# EAGLE design BMSv2 (EAGLE 7.6.0)
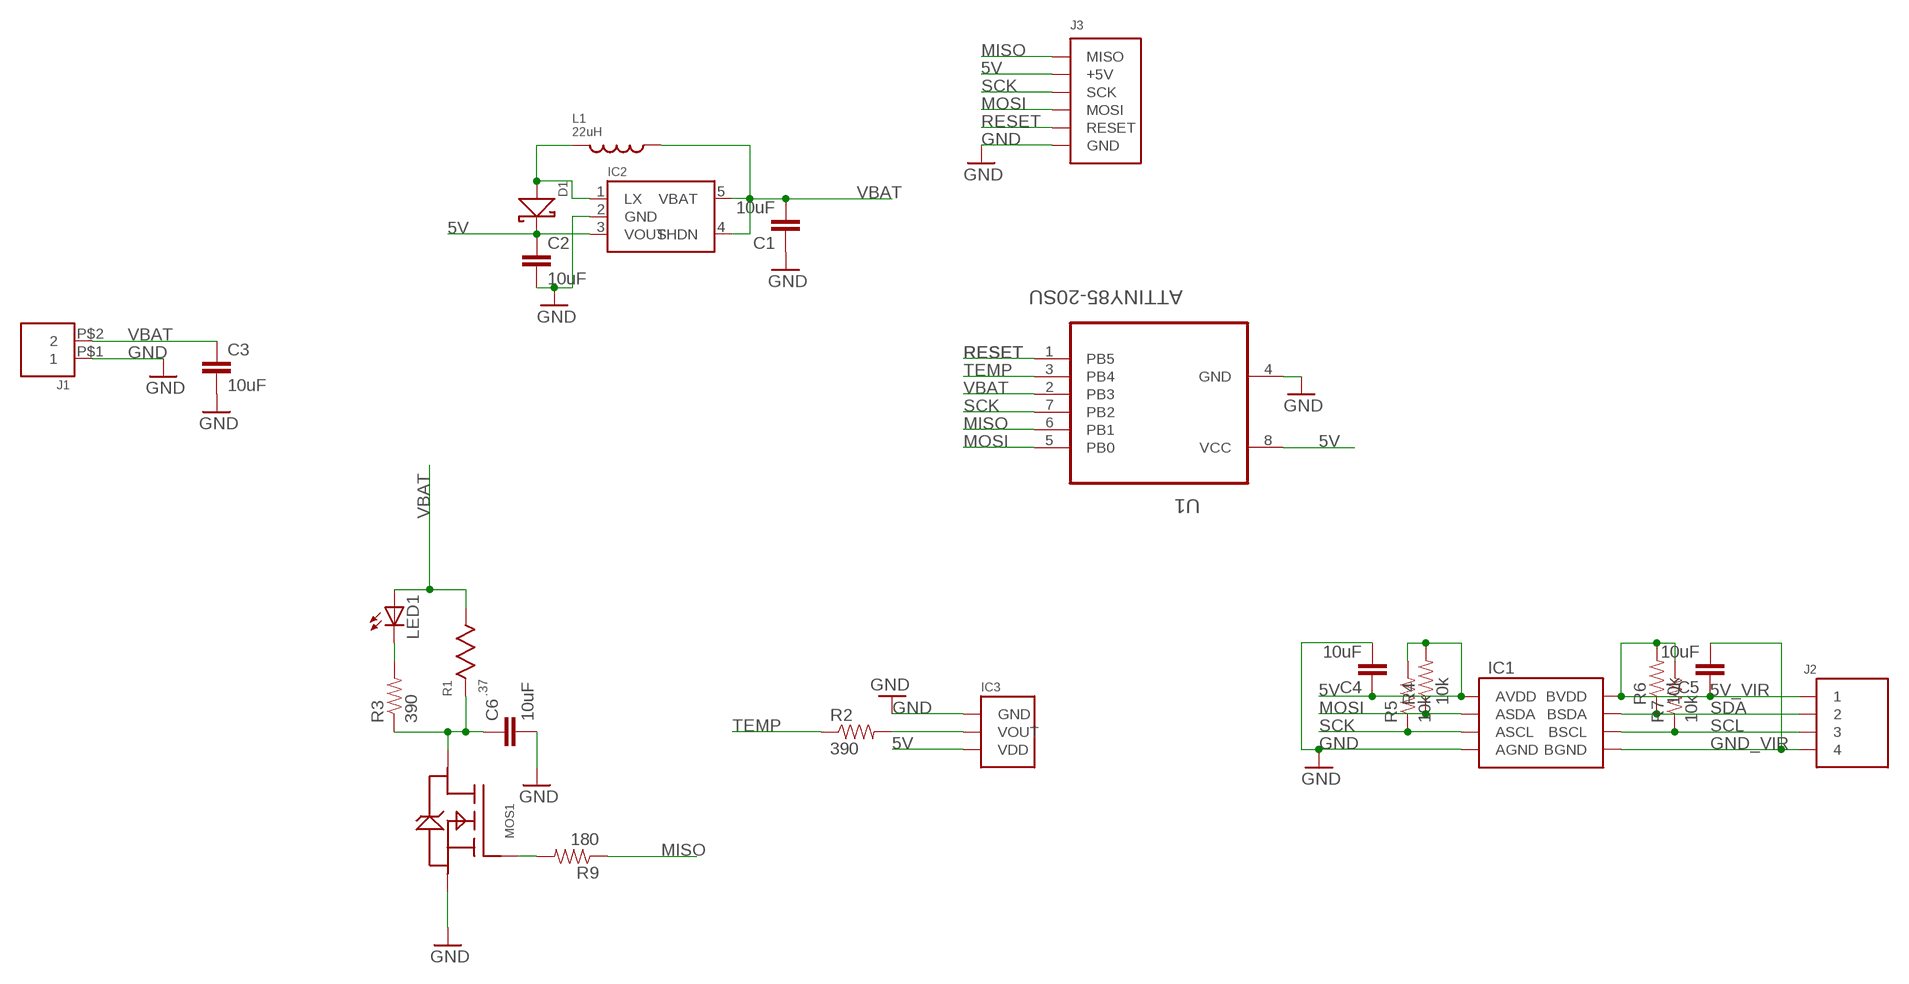
[diagram p0: schematic, sheet 1]

## Parts
C1  10uF  10UF10V10%(0805)  [0805-CAP]
C2  10uF  10UF10V10%(0805)  [0805-CAP]
C3  10uF  10UF10V10%(0805)  [0805-CAP]
C4  10uF  10UF10V10%(0805)  [0805-CAP]
C5  10uF  10UF10V10%(0805)  [0805-CAP]
C6  10uF  10UF10V10%(0805)  [0805-CAP]
D1  DIODE_SCHOTTKYSOD-123  [SOD-123]
IC1  SI8600_DUALCHANNELISO  [SOIC-8]
IC2  SP6641  [SOT-23]
IC3  TEMP_MCP9701  [SOT-23-3]
J1  CONNECTOR_2PIN  [2PIN_.1']
J2  CONNECTOR_4PIN  [4PIN_.1']
J3  ISPHEADER  [2X3PIN_.1']
L1  22uH  CHIP_IND1  [6X6MM_IND]
LED1  LEDCHIPLED_0805  [CHIPLED_0805]
MOS1  MOS_N_LOGIC_PSMN7R0  [LFPAK]
R1  .37  RES_THROUGH  [TO-220-2]
R2  390  0.3OHM-1/8W-1%(0805)  [0805]
R3  390  0.3OHM-1/8W-1%(0805)  [0805]
R4  10k  0.3OHM-1/8W-1%(0805)  [0805]
R5  10k  0.3OHM-1/8W-1%(0805)  [0805]
R6  10k  0.3OHM-1/8W-1%(0805)  [0805]
R7  10k  0.3OHM-1/8W-1%(0805)  [0805]
R9  180  0.3OHM-1/8W-1%(0805)  [0805]
U1  ATTINY85-20SU  [SOIC127P798X216-8N]

## Nets
5V: C2.1 C4.1 D1.CATHODE IC1.P$1(AVDD) IC2.3(VOUT) IC3.1(VDD) J3.P$2(+5V) R4.2 R5.2 U1.8(VCC)
5V_VIR: C5.1 IC1.P$8(BVDD) J2.P$1 R6.2 R7.2
GND: C1.1 C2.2 C3.2 C4.2 C6.2 IC1.P$4(AGND) IC2.2(GND) IC3.3(GND) J1.P$1 J3.P$6(GND) MOS1.P$1(SOURCE) MOS1.P$2(SOURCE) MOS1.P$3(SOURCE) U1.4(GND)
GND_VIR: C5.2 IC1.P$5(BGND) J2.P$4
MISO: J3.P$1(MISO) R9.1 U1.6(PB1)
MOSI: IC1.P$2(ASDA) J3.P$4(MOSI) R4.1 U1.5(PB0)
N$2: MOS1.P$4(GATE) R9.2
N$3: LED1.C R3.2
N$14: C6.1 MOS1.P$5(DRAIN) R1.P$1 R3.1
N$17: IC3.2(VOUT) R2.2
N$29: D1.ANODE IC2.1(LX) L1.P$1
RESET: J3.P$5(RESET) U1.1(PB5)
SCK: IC1.P$3(ASCL) J3.P$3(SCK) R5.1 U1.7(PB2)
SCL: IC1.P$6(BSCL) J2.P$3 R7.1
SDA: IC1.P$7(BSDA) J2.P$2 R6.1
TEMP: R2.1 U1.3(PB4)
VBAT: C1.2 C3.1 IC2.4(SHDN) IC2.5(VBAT) J1.P$2 L1.P$2 LED1.A R1.P$2 U1.2(PB3)

## Library data of the parts
C1-C6 = SparkFun-Capacitors:10UF10V10%(0805): CAP-11330; PROD_ID: CAP-11330
D1 = lolomolo:DIODE_SCHOTTKY
IC1 = lolomolo:SI8600_DUALCHANNELISO
IC2 = lolomolo:SP6641
IC3 = lolomolo:TEMP_MCP9701
J1 = lolomolo:CONNECTOR_2PIN
J2 = lolomolo:CONNECTOR_4PIN
J3 = lolomolo:ISPHEADER
L1 = lolomolo:CHIP_IND: Chip Inductor
LED1 = adafruit:LED: LED OSRAM: - CHIPLED LG R971, LG N971, LY N971, LG Q971, LY Q971, LO R971, LY R971 LH N974, LH R974 LS Q976, LO Q976, LY Q976 LO Q996 - Hyper CHIPLED LW Q18S LB Q993, LB Q99A, LB R99A - SideLED LS A670, LO A670, LY A670, LG A670, LP A670 LB A673, LV A673, LT A673, LW A673 LH A674 LY A675 LS A676, LA A676, LO A676, LY A676, LW A676 LS A679, LY A679, LG A679 - Hyper Micro SIDELED® LS Y876, LA Y876, LO Y876, LY Y876 LT Y87S - SmartLED LW L88C, LW L88S LB L89C, LB L89S, LG L890 LS L89K, LO L89K, LY L89K LS L896, LA L896, LO L896, LY L896 - TOPLED LS T670, LO T670, LY T670, LG T670, LP T670 LSG T670, LSP T670, LSY T670, LOP T670, LYG T670 LG T671, LOG T671, LSG T671 LB T673, LV T673, LT T673, LW T673 LH T674 LS T676, LA T676, LO T676, LY T676, LB T676, LH T676, LSB T676, LW T676 LB T67C, LV T67C, LT T67C, LS T67K, LO T67K, LY T67K, LW E67C LS E67B, LA E67B, LO E67B, LY E67B, LB E67C, LV E67C, LT E67C LW T67C LS T679, LY T679, LG T679 LS T770, LO T770, LY T770, LG T770, LP T770 LB T773, LV T773, LT T773, LW T773 LH T774 LS E675, LA E675, LY E675, LS T675 LS T776, LA T776, LO T776, LY T776, LB T776 LHGB T686 LT T68C, LB T68C - Hyper Mini TOPLED® LB M676 - Mini TOPLED Santana® LG M470 LS M47K, LO M47K, LY M47K Source: http://www.osram.convergy.de/
MOS1 = lolomolo:MOS_N_LOGIC_PSMN7R0
R1 = lolomolo:RES_THROUGH
R2-R7 R9 = SparkFun-Resistors:0.3OHM-1/8W-1%(0805): RES-11622; PROD_ID: RES-11622; VALUE: 0.3
U1 = Atmel_By_element14_Batch_1-00:ATTINY85-20SU: 8-bit Microcontroller with In-System Programmable Flash; MPN: ATTINY85-20SU; OC_FARNELL: 1455164; OC_NEWARK: 58M3797; PACKAGE: SOIC-8; SUPPLIER: Atmel

## Board
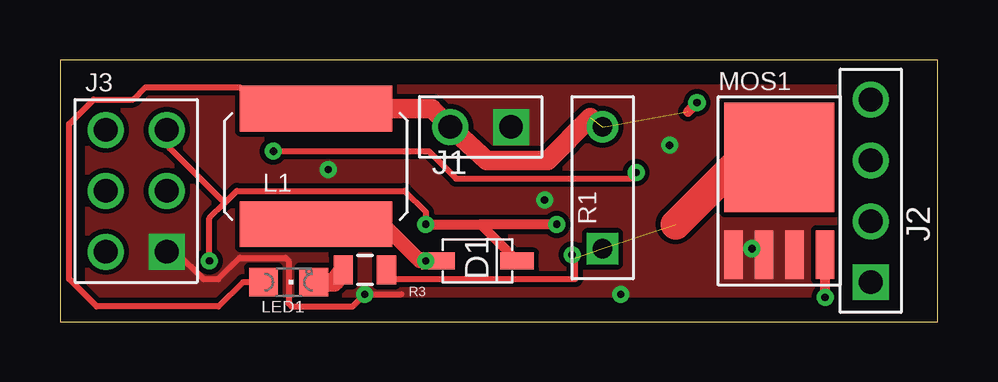
[diagram p1: board, top side]
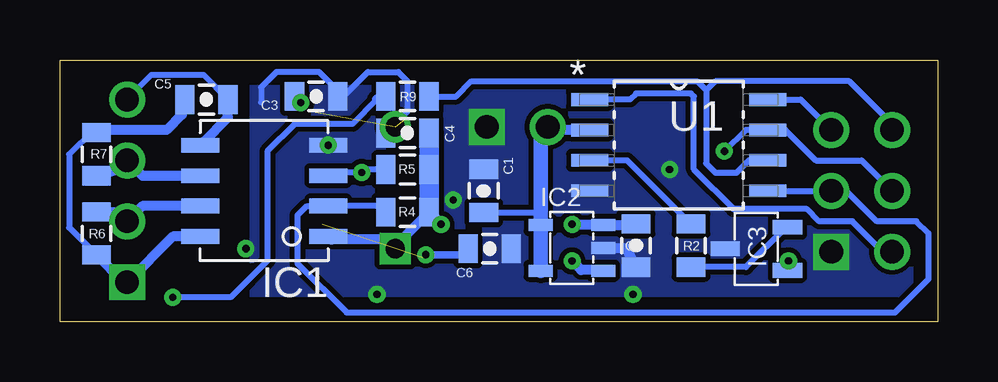
[diagram p2: board, bottom side, seen from below]

Size 36.58 x 10.92 mm. Coordinates in mm from the lower left corner, seen from the top.
Outline: 0,0 36.58,0 36.58,10.92 0,10.92 0,0
Copper layers (1*16): Top 0.035mm / dielectric 1.5mm / Bottom 0.035mm
Design rules "default": minimum track width 10mil, minimum drill 24mil, track to track 8mil, track to pad 8mil, pad to pad 8mil, via to via 8mil, smd to smd 8mil, copper to edge 40mil, drill to drill 8mil, minimum pad ring 10mil, minimum via ring 8mil, stop-mask expansion 4mil, vias tented up to drill 0mil, thermal gap 10mil

### Footprints (pad centres in the part's own frame; a part is rotated, then mirrored left to right if it is on the bottom)
0805-CAP = smd 0.8 x 1.2: 1 -0.9,0; 2 0.9,0
SOD-123 = smd 1.4 x 0.7: ANODE 0,0; CATHODE 3.3,0
SOIC-8 = smd 1.575 x 0.61: P$1 0,3.81; P$2 0,2.54; P$3 0,1.27; P$4 0,0; P$5 5.334,0; P$6 5.334,1.27; P$7 5.334,2.54; P$8 5.334,3.81
SOT-23 = smd 1 x 0.5: 1 1.29,-0.92; 2 1.29,0.03; 3 1.29,0.98; 4 -1.31,0.98; 5 -1.31,-0.92
SOT-23-3 = smd 1.219 x 0.61: 1 -1.36,0.78; 2 -1.36,-1.02; 3 1.24,-0.12
2PIN_.1' = drill 0.991 square: P$1 -1.27,0 | drill 0.991: P$2 1.27,0
4PIN_.1' = drill 0.991 square: P$1 -3.81,0 | drill 0.991: P$2 -1.27,0; P$3 1.27,0; P$4 3.81,0
2X3PIN_.1' = drill 0.991: P$1 -1.27,1.27; P$2 1.27,1.27; P$3 -1.27,-1.27; P$4 1.27,-1.27; P$5 -1.27,-3.81 | drill 0.991 square: P$6 1.27,-3.81
6X6MM_IND = smd 1.905 x 6.35: P$1 -2.413,0; P$2 2.413,0
CHIPLED_0805 = smd 1.2 x 1.2: A 0,-1.05; C 0,1.05
LFPAK = smd 0.762 x 2.032: P$1 0,0; P$2 1.27,0; P$3 2.54,0; P$4 3.81,0 | smd 4.572 x 4.572: P$5 1.905,4.064
TO-220-2 = drill 0.8 square: P$1 -2.54,0 | drill 0.8: P$2 2.54,0
0805 = smd 0.8 x 1.2: 1 -0.9,0; 2 0.9,0
SOIC127P798X216-8N = smd 1.549 x 0.533: 1 -3.708,1.905; 2 -3.708,0.635; 3 -3.708,-0.635; 4 -3.708,-1.905; 5 3.708,-1.905; 6 3.708,-0.635; 7 3.708,0.635; 8 3.708,1.905

### Placement (x,y rotation side)
C1  18.92,5.46 270 bottom
C2  12.57,3.18 270 bottom
C3  25.91,9.4 0 bottom
C4  22.1,7.87 180 bottom
C5  30.48,9.27 0 bottom
C6  18.67,3.05 0 bottom
D1  15.75,2.54 0 top
IC1  25.4,7.37 180 bottom
IC2  15.24,3.05 0 bottom
IC3  7.62,2.92 180 bottom
J1  17.53,8.13 180 top
J2  33.78,5.46 90 top
J3  3.17,6.73 0 top
L1  10.67,6.48 90 top
LED1  9.53,1.65 270 top
MOS1  28.07,2.79 0 top
R1  22.61,5.59 90 top
R2  10.29,3.18 270 bottom
R3  12.7,2.16 180 top
R4  22.1,4.57 0 bottom
R5  22.1,6.35 0 bottom
R6  35.05,3.68 270 bottom
R7  35.05,6.98 90 bottom
R9  22.1,9.4 180 bottom
U1  10.79,7.37 0 bottom

### Tracks (layer width: path | path; a pad name or v marks a point on that pad's centre or on a via)
5V  (via drill 0.3)
  Top 0.254: 6.86,4.95 7.37,5.46 14.35,5.46 15.24,4.57 v15.24,4.06 | 6.86,4.95 4.57,7.24 4.57,7.87 J3.P$2 | v6.22,2.54 6.22,4.32 6.86,4.95
  Top 0.406: v15.24,4.06 17.52,4.06 | 17.52,4.06 D1.CATHODE | v20.7,4.06 17.52,4.06
  Bottom 0.254: U1.8 5.71,9.27 J3.P$2 | IC3.1 6.26,2.5 v6.22,2.54
  Bottom 0.406: C2.1 12.24,4.03 IC2.3 15.2,4.03 v15.24,4.06 | IC1.P$1 25.27,3.43 22.34,3.43 R4.2 21.07,4.45 v20.7,4.06
  Bottom 0.813: R4.2 R5.2 C4.1
5V_VIR
  Bottom 0.254: 32.13,8 35.18,8 36.2,6.98 36.2,3.93 R6.2
  Bottom 0.406: R6.2 33.92,1.65 J2.P$1 31.88,3.56 IC1.P$8 | C5.1 31.5,9.16 31.5,8.64 32.13,8 34.91,8 R7.2
GND  (via drill 0.3)
  Top 0.254: J3.P$6 4.83,2.92 5.97,1.78 6.6,1.78 7.49,2.67 9.4,2.67 9.53,2.54 9.53,0.76 9.65,0.63 12.19,0.63 v12.7,1.14 14.22,1.14
  Bottom 0.254: 28.19,9.14 28.19,9.78 27.56,10.41 25.78,10.41 25.01,9.64 C3.2 24.76,9.4 23.75,10.41 22.48,10.41 22.1,10.03 22.1,8.77 C4.2
  Bottom 0.406: IC2.2 13,3.08 C2.2
  other vias: 25.4,7.37 28.83,3.05 23.37,1.14 20.19,5.08 11.18,6.35
  pour Bottom (no thermals): 0,10.92 28.57,10.92 28.57,0 0,0
  pour Top (no thermals): 0,10.92 32.26,10.92 32.26,0 0,0
GND_VIR
  Bottom 0.254: 30.6,7.5 IC1.P$5 | C5.2 30.6,10.29 32.77,10.29 J2.P$4
  Bottom 0.406: 30.6,7.5 29.58,8.52 C5.2
MISO
  Bottom 0.254: J3.P$1 1.91,8.25 3.68,10.03 9.27,10.03 9.65,9.65 | 9.65,9.65 9.65,6.6 9.27,6.22 8.38,6.22 7.87,6.73 U1.6 | 9.65,9.65 10.03,10.03 19.43,10.03 20.07,9.4 R9.1
MOSI
  Bottom 0.254: U1.5 J3.P$4 3.81,5.46 2.54,4.19 0.89,4.19 0.38,3.68 0.38,1.78 1.78,0.38 24.64,0.38 26.67,2.41 26.67,4.45 26.29,4.83 IC1.P$2 23.25,4.83 R4.1
  Bottom 0.305: IC1.P$2 25.27,4.7
N$2  (via drill 0.3)
  Top 0.406: v31.88,1.02 MOS1.P$4
  Bottom 0.254: v31.88,1.02 29.46,1.02 27.94,2.54 27.94,7.11 26.8,8.25 24.38,8.25 23.37,9.27
  Bottom 0.406: R9.2 23.12,9.27 23.37,9.27
N$3
  Top 0.254: 11.55,1.9 R3.2
  Top 0.762: LED1.C 11.42,1.65 R3.2
N$14  (via drill 0.3)  (2 unrouted)
  Top 0.254: R3.1 13.84,1.78 21.46,1.78 21.46,2.67
  Top 0.305: 21.46,2.67 v21.34,2.79
  Top 1.27: 25.65,4.06 28.32,6.73 29.84,6.73 MOS1.P$5
  Bottom 0.305: v21.34,2.79 19.82,2.79 C6.1
N$17
  Bottom 0.254: IC3.2 6.35,3.94 8,2.29 10.53,2.29 R2.2
N$29  (via drill 0.3)
  Top 0.61: D1.ANODE v15.24,2.54 14.99,2.54 13.46,4.06 L1.P$1
  Bottom 0.305: IC2.1 13.98,2.16
  Bottom 0.406: 13.98,2.16 14.86,2.16 v15.24,2.54
RESET
  Bottom 0.254: J3.P$5 2.29,2.92 3.56,4.19 4.95,4.19 5.46,4.7 8.51,4.7 10.16,6.35 10.16,9.4 10.29,9.52 12.57,9.52 12.83,9.27 U1.1
SCK  (via drill 0.3)
  Top 0.254: v8.89,7.11 15.37,7.11 16.51,5.97 23.75,5.97 v24,6.22
  Bottom 0.254: J3.P$3 3.17,6.73 5.08,6.73 6.35,8 U1.7 8,8 v8.89,7.11 | IC1.P$3 25.27,6.22 v24,6.22 23.88,6.35 R5.1
SCL
  Bottom 0.254: IC1.P$6 30.74,6.09
  Bottom 0.406: 30.74,6.09 33.14,6.09 J2.P$3 34.17,6.34 R7.1
SDA
  Bottom 0.406: IC1.P$7 33.15,4.83 J2.P$2 34.17,4.58 R6.1
TEMP
  Bottom 0.254: R2.1 12.94,6.73 U1.3
VBAT  (via drill 0.3)  (2 unrouted)
  Top 0.254: LED1.A 7.62,1.65 6.6,0.63 1.52,0.63 0.38,1.78 0.38,8.25 1.4,9.27 3.05,9.27 3.56,9.78 7.49,9.78 7.75,9.52 10.03,9.52 L1.P$2
  Top 0.406: v26.54,9.14 26.16,8.76
  Top 0.813: L1.P$2 15.49,8.89 J1.P$2 17.78,6.73 20.32,6.73 22.1,8.51
  Bottom 0.254: 16.55,4.88 16.55,4.57 16.56,4.56 C1.2
  Bottom 0.406: U1.2 16.13,8 J1.P$2 | C3.1 26.81,9.14 v26.54,9.14
  Bottom 0.61: IC2.5 IC2.4 16.55,4.57 16.55,7.83 J1.P$2